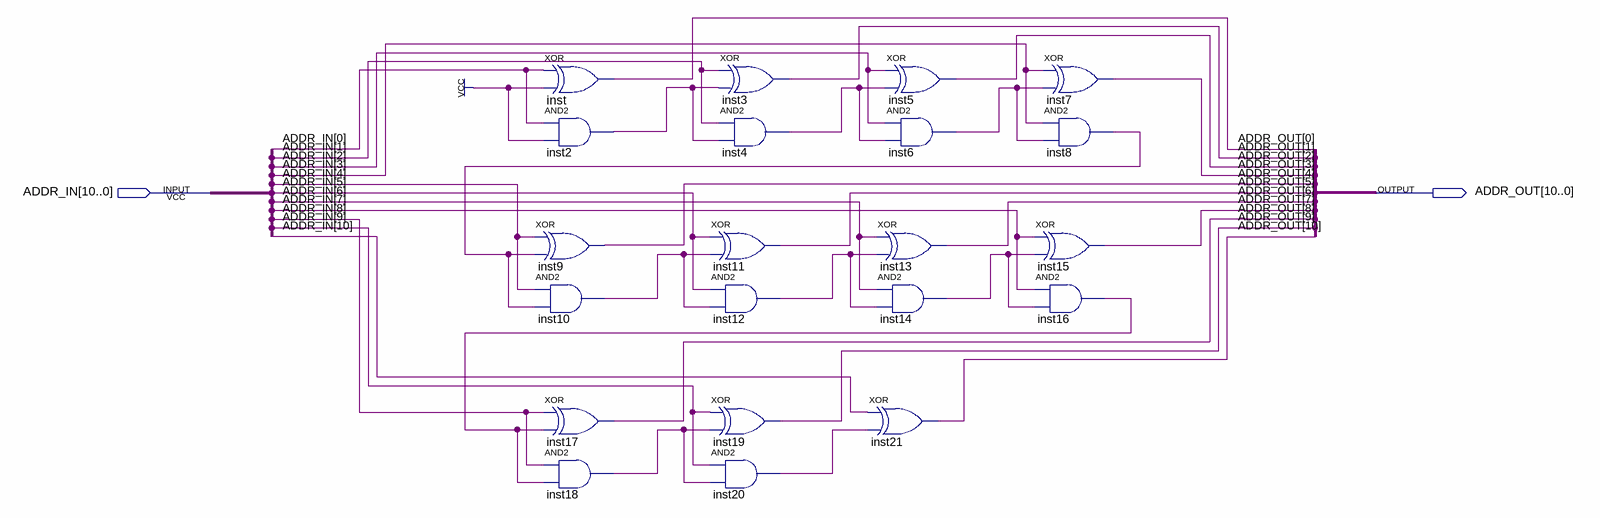
[diagram p0: schematic sheet]
// Quartus schematic INC_11b.bdf as structural Verilog: 21 symbols, 2 pins
module INC_11b (
  input  [10:0] ADDR_IN,
  output [10:0] ADDR_OUT
);

  wire inst2_out, inst4_out, inst6_out, inst8_out, inst10_out, inst12_out, inst14_out, inst16_out,
       inst18_out, inst20_out;

  xor inst (ADDR_OUT[0], ADDR_IN[0], 1'b1);
  and inst2 (inst2_out, ADDR_IN[0], 1'b1);
  xor inst9 (ADDR_OUT[4], ADDR_IN[4], inst8_out);
  and inst10 (inst10_out, ADDR_IN[4], inst8_out);
  xor inst17 (ADDR_OUT[8], ADDR_IN[8], inst16_out);
  and inst18 (inst18_out, ADDR_IN[8], inst16_out);
  xor inst3 (ADDR_OUT[1], ADDR_IN[1], inst2_out);
  and inst4 (inst4_out, ADDR_IN[1], inst2_out);
  xor inst11 (ADDR_OUT[5], ADDR_IN[5], inst10_out);
  and inst12 (inst12_out, ADDR_IN[5], inst10_out);
  xor inst19 (ADDR_OUT[9], ADDR_IN[9], inst18_out);
  and inst20 (inst20_out, ADDR_IN[9], inst18_out);
  xor inst5 (ADDR_OUT[2], ADDR_IN[2], inst4_out);
  and inst6 (inst6_out, ADDR_IN[2], inst4_out);
  xor inst13 (ADDR_OUT[6], ADDR_IN[6], inst12_out);
  and inst14 (inst14_out, ADDR_IN[6], inst12_out);
  xor inst21 (ADDR_OUT[10], ADDR_IN[10], inst20_out);
  xor inst7 (ADDR_OUT[3], ADDR_IN[3], inst6_out);
  and inst8 (inst8_out, ADDR_IN[3], inst6_out);
  xor inst15 (ADDR_OUT[7], ADDR_IN[7], inst14_out);
  and inst16 (inst16_out, ADDR_IN[7], inst14_out);
endmodule
